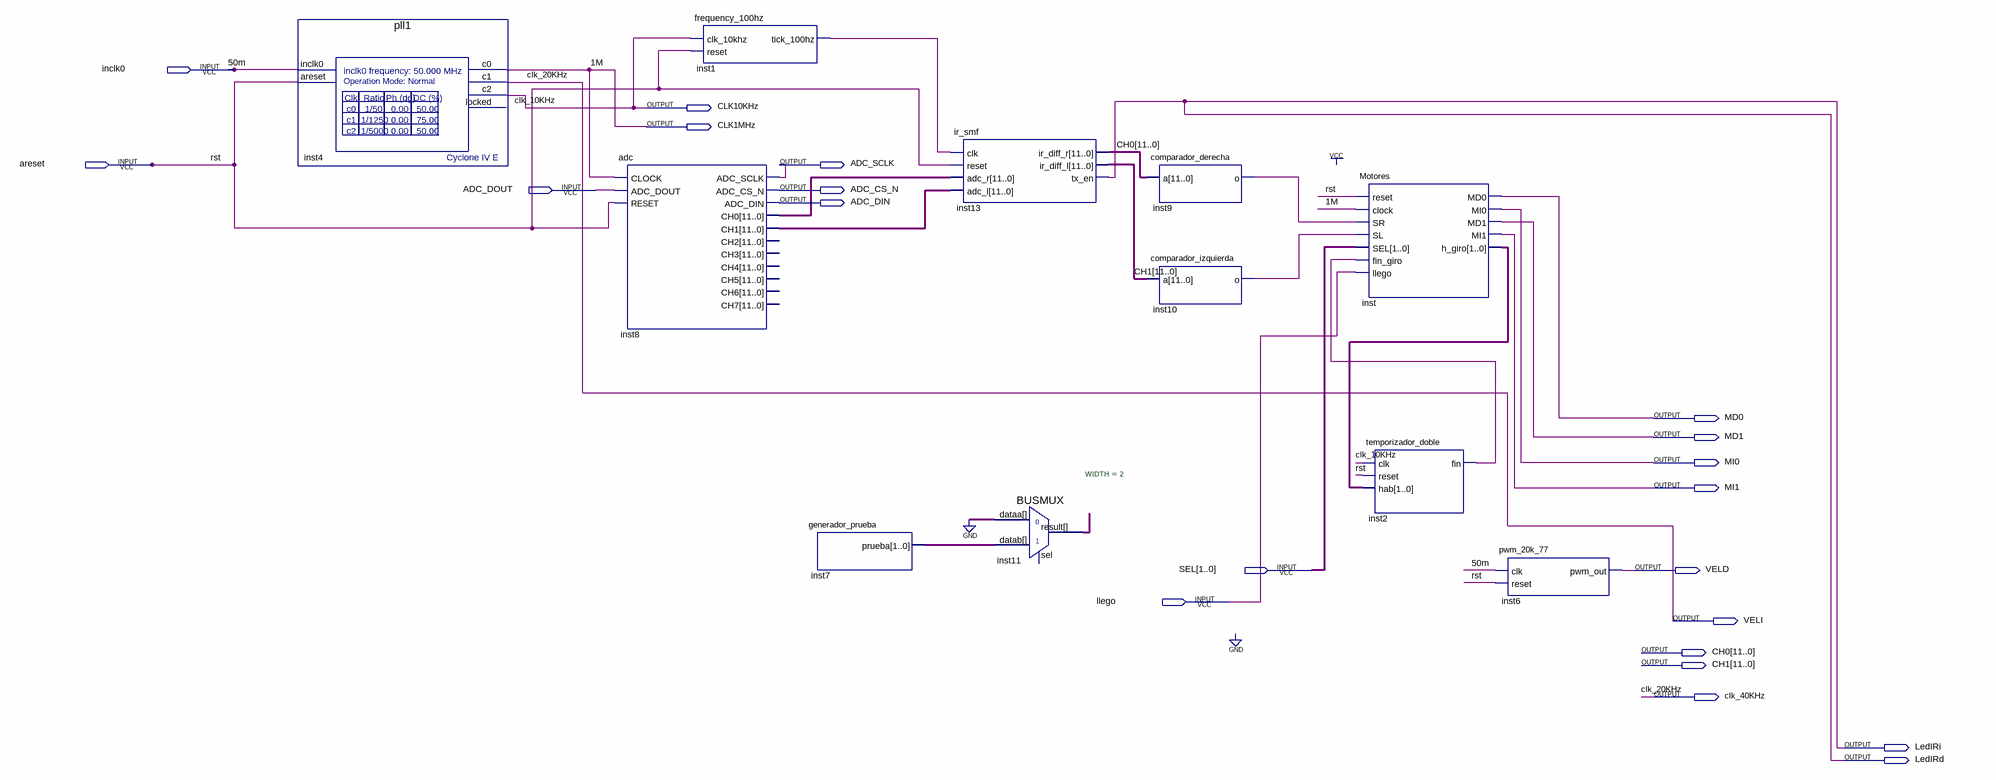
[diagram p0: schematic sheet]
// Quartus schematic Control_Motores.bdf as structural Verilog: 11 symbols, 21 pins
module Control_Motores (
  input  inclk0,
  input  areset,
  input  ADC_DOUT,
  input  [1:0] SEL,
  input  llego,
  output CLK10KHz,
  output CLK1MHz,
  output ADC_SCLK,
  output ADC_CS_N,
  output ADC_DIN,
  output MD0,
  output MD1,
  output MI0,
  output MI1,
  output VELD,
  output VELI,
  output [11:0] CH0,
  output [11:0] CH1,
  output clk_40KHz,
  output LedIRi,
  output LedIRd
);

  wire inst1_tick_100hz, inst2_fin, inst9_o, inst10_o;
  wire [1:0] inst7_prueba, inst11_result, inst_h_giro;
  wire [11:0] inst8_ch0, inst8_ch1;

  pll1 inst4 (.inclk0(inclk0), .areset(areset), .c0(CLK1MHz), .c1(clk_40KHz), .c2(CLK10KHz));  // open: locked
  adc inst8 (
    .CLOCK(CLK1MHz), .ADC_DOUT(ADC_DOUT), .RESET(areset), .ADC_SCLK(ADC_SCLK), .ADC_CS_N(ADC_CS_N),
    .ADC_DIN(ADC_DIN), .CH0(inst8_ch0), .CH1(inst8_ch1));  // open: CH2, CH3, CH4, CH5, CH6, CH7
  frequency_100hz inst1 (.clk_10khz(CLK10KHz), .reset(areset), .tick_100hz(inst1_tick_100hz));
  generador_prueba inst7 (.prueba(inst7_prueba));
  ir_smf inst13 (
    .clk(inst1_tick_100hz), .reset(areset), .adc_r(inst8_ch0), .adc_l(inst8_ch1), .ir_diff_r(CH0),
    .ir_diff_l(CH1), .tx_en(LedIRd));
  BUSMUX #(.WIDTH(2)) inst11 (.datab(inst7_prueba), .dataa(2'b00), .result(inst11_result));  // open: sel
  comparador_derecha inst9 (.a(CH0), .o(inst9_o));
  comparador_izquierda inst10 (.a(CH1), .o(inst10_o));
  Motores inst (
    .reset(areset), .clock(CLK1MHz), .SR(inst9_o), .SL(inst10_o), .SEL(SEL), .fin_giro(inst2_fin),
    .llego(llego), .MD0(MD0), .MI0(MI0), .MD1(MD1), .MI1(MI1), .h_giro(inst_h_giro));
  temporizador_doble inst2 (.clk(CLK10KHz), .reset(areset), .hab(inst_h_giro), .fin(inst2_fin));
  pwm_20k_77 inst6 (.clk(inclk0), .reset(areset), .pwm_out(VELD));

  assign LedIRi = LedIRd;
  assign VELI = clk_40KHz;

  // Other names for the same wires on the sheet: rst = areset; 1M = CLK1MHz; clk_10KHz = CLK10KHz;
  //   clk_20KHz = clk_40KHz; 50m = inclk0
endmodule
